# Altium schematic sheet FPGA power.SchDoc: FPGA power
size A4; Organization: Blinkinlabs, LLC; DocumentNumber: 11; SheetNumber: 12; SheetTotal: 14
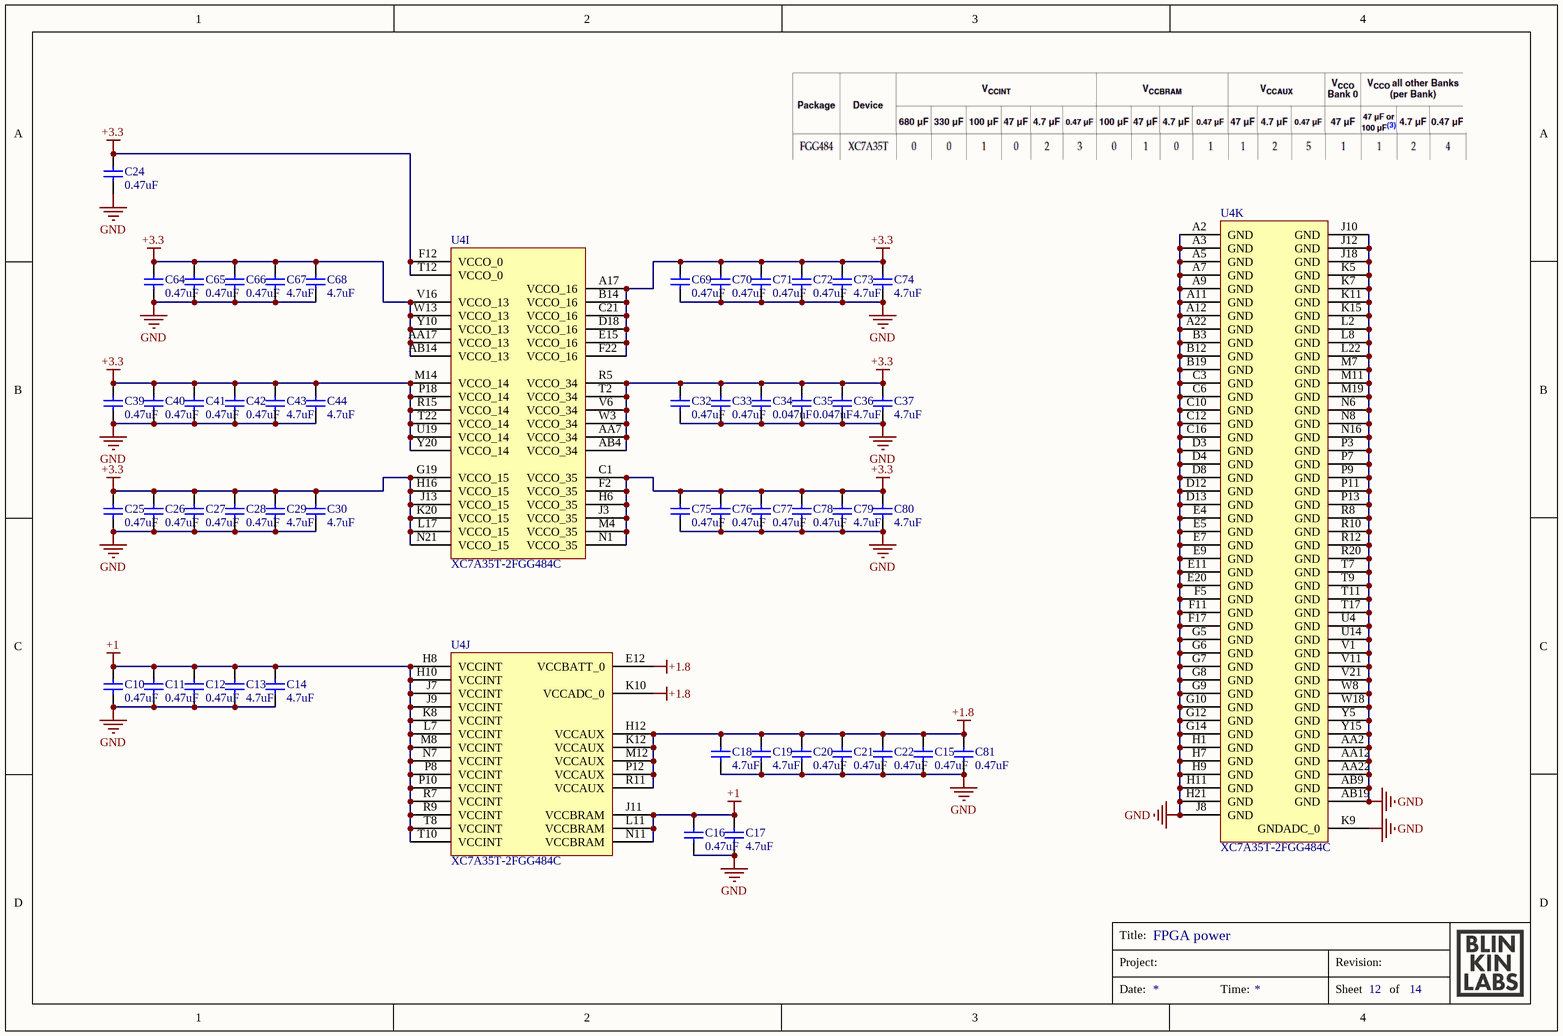
[diagram p0: FPGA power.SchDoc]

## Parts
C10  0.47uF  [CAPC1005X06L]
C11  0.47uF  [CAPC1005X06L]
C12  0.47uF  [CAPC1005X06L]
C13  4.7uF  [CAPC1005X06L]
C14  4.7uF  [CAPC1005X06L]
C15  0.47uF  [CAPC1005X06L]
C16  0.47uF  [CAPC1005X06L]
C17  4.7uF  [CAPC1005X06L]
C18  4.7uF  [CAPC1005X06L]
C19  4.7uF  [CAPC1005X06L]
C20  0.47uF  [CAPC1005X06L]
C21  0.47uF  [CAPC1005X06L]
C22  0.47uF  [CAPC1005X06L]
C24  0.47uF  [CAPC1005X06L]
C25  0.47uF  [CAPC1005X06L]
C26  0.47uF  [CAPC1005X06L]
C27  0.47uF  [CAPC1005X06L]
C28  0.47uF  [CAPC1005X06L]
C29  4.7uF  [CAPC1005X06L]
C30  4.7uF  [CAPC1005X06L]
C32  0.47uF  [CAPC1005X06L]
C33  0.47uF  [CAPC1005X06L]
C34  0.047uF  [CAPC1005X06L]
C35  0.047uF  [CAPC1005X06L]
C36  4.7uF  [CAPC1005X06L]
C37  4.7uF  [CAPC1005X06L]
C39  0.47uF  [CAPC1005X06L]
C40  0.47uF  [CAPC1005X06L]
C41  0.47uF  [CAPC1005X06L]
C42  0.47uF  [CAPC1005X06L]
C43  4.7uF  [CAPC1005X06L]
C44  4.7uF  [CAPC1005X06L]
C64  0.47uF  [CAPC1005X06L]
C65  0.47uF  [CAPC1005X06L]
C66  0.47uF  [CAPC1005X06L]
C67  4.7uF  [CAPC1005X06L]
C68  4.7uF  [CAPC1005X06L]
C69  0.47uF  [CAPC1005X06L]
C70  0.47uF  [CAPC1005X06L]
C71  0.47uF  [CAPC1005X06L]
C72  0.47uF  [CAPC1005X06L]
C73  4.7uF  [CAPC1005X06L]
C74  4.7uF  [CAPC1005X06L]
C75  0.47uF  [CAPC1005X06L]
C76  0.47uF  [CAPC1005X06L]
C77  0.47uF  [CAPC1005X06L]
C78  0.47uF  [CAPC1005X06L]
C79  4.7uF  [CAPC1005X06L]
C80  4.7uF  [CAPC1005X06L]
C81  0.47uF  [CAPC1005X06L]
U4  XC7A35T-2FGG484C  [FGG484]  (parts I,J,K of 12)

## Nets
+1: C10.1 C11.1 C12.1 C13.2 C14.2 C16.1 C17.2 U4.H8(VCCINT) U4.H10(VCCINT) U4.J7(VCCINT) U4.J9(VCCINT) U4.J11(VCCBRAM) U4.K8(VCCINT) U4.L7(VCCINT) U4.L11(VCCBRAM) U4.M8(VCCINT) U4.N7(VCCINT) U4.N11(VCCBRAM) U4.P8(VCCINT) U4.P10(VCCINT) U4.R7(VCCINT) U4.R9(VCCINT) U4.T8(VCCINT) U4.T10(VCCINT)
+1.8: C15.1 C18.2 C19.2 C20.1 C21.1 C22.1 C81.1 U4.E12(VCCBATT_0) U4.H12(VCCAUX) U4.K10(VCCADC_0) U4.K12(VCCAUX) U4.M12(VCCAUX) U4.P12(VCCAUX) U4.R11(VCCAUX)
+3.3: C24.1 C25.1 C26.1 C27.1 C28.1 C29.2 C30.2 C32.1 C33.1 C34.1 C35.1 C36.2 C37.2 C39.1 C40.1 C41.1 C42.1 C43.2 C44.2 C64.1 C65.1 C66.1 C67.2 C68.2 C69.1 C70.1 C71.1 C72.1 C73.2 C74.2 C75.1 C76.1 C77.1 C78.1 C79.2 C80.2 U4.A17(VCCO_16) U4.AA7(VCCO_34) U4.AA17(VCCO_13) U4.AB4(VCCO_34) U4.AB14(VCCO_13) U4.B14(VCCO_16) U4.C1(VCCO_35) U4.C21(VCCO_16) U4.D18(VCCO_16) U4.E15(VCCO_16) U4.F2(VCCO_35) U4.F12(VCCO_0) U4.F22(VCCO_16) U4.G19(VCCO_15) U4.H6(VCCO_35) U4.H16(VCCO_15) U4.J3(VCCO_35) U4.J13(VCCO_15) U4.K20(VCCO_15) U4.L17(VCCO_15) U4.M4(VCCO_35) U4.M14(VCCO_14) U4.N1(VCCO_35) U4.N21(VCCO_15) U4.P18(VCCO_14) U4.R5(VCCO_34) U4.R15(VCCO_14) U4.T2(VCCO_34) U4.T12(VCCO_0) U4.T22(VCCO_14) U4.U19(VCCO_14) U4.V6(VCCO_34) U4.V16(VCCO_13) U4.W3(VCCO_34) U4.W13(VCCO_13) U4.Y10(VCCO_13) U4.Y20(VCCO_14)
GND: C10.2 C11.2 C12.2 C13.1 C14.1 C15.2 C16.2 C17.1 C18.1 C19.1 C20.2 C21.2 C22.2 C24.2 C25.2 C26.2 C27.2 C28.2 C29.1 C30.1 C32.2 C33.2 C34.2 C35.2 C36.1 C37.1 C39.2 C40.2 C41.2 C42.2 C43.1 C44.1 C64.2 C65.2 C66.2 C67.1 C68.1 C69.2 C70.2 C71.2 C72.2 C73.1 C74.1 C75.2 C76.2 C77.2 C78.2 C79.1 C80.1 C81.2 U4.A2(GND) U4.A3(GND) U4.A5(GND) U4.A7(GND) U4.A9(GND) U4.A11(GND) U4.A12(GND) U4.A22(GND) U4.AA2(GND) U4.AA12(GND) U4.AA22(GND) U4.AB9(GND) U4.AB19(GND) U4.B3(GND) U4.B12(GND) U4.B19(GND) U4.C3(GND) U4.C6(GND) U4.C10(GND) U4.C12(GND) U4.C16(GND) U4.D3(GND) U4.D4(GND) U4.D8(GND) U4.D12(GND) U4.D13(GND) U4.E4(GND) U4.E5(GND) U4.E7(GND) U4.E9(GND) U4.E11(GND) U4.E20(GND) U4.F5(GND) U4.F11(GND) U4.F17(GND) U4.G5(GND) U4.G6(GND) U4.G7(GND) U4.G8(GND) U4.G9(GND) U4.G10(GND) U4.G12(GND) U4.G14(GND) U4.H1(GND) U4.H7(GND) U4.H9(GND) U4.H11(GND) U4.H21(GND) U4.J8(GND) U4.J10(GND) U4.J12(GND) U4.J18(GND) U4.K5(GND) U4.K7(GND) U4.K9(GNDADC_0) U4.K11(GND) U4.K15(GND) U4.L2(GND) U4.L8(GND) U4.L22(GND) U4.M7(GND) U4.M11(GND) U4.M19(GND) U4.N6(GND) U4.N8(GND) U4.N16(GND) U4.P3(GND) U4.P7(GND) U4.P9(GND) U4.P11(GND) U4.P13(GND) U4.R8(GND) U4.R10(GND) U4.R12(GND) U4.R20(GND) U4.T7(GND) U4.T9(GND) U4.T11(GND) U4.T17(GND) U4.U4(GND) U4.U14(GND) U4.V1(GND) U4.V11(GND) U4.V21(GND) U4.W8(GND) U4.W18(GND) U4.Y5(GND) U4.Y15(GND)

## Notes on the sheet
- Title:
- Project:
- Revision:
- Date:
- Time:
- Sheet
- of

## Library data of the parts
C10-C12 C15 C16 C20-C22 C24-C28 C32 C33 C39-C42 C64-C66 C69-C72 C75-C78 C81 = GRM155R60J474KE19D: CAP CER 0.47UF 6.3V X5R 0402; Manufacturer: Murata Electronics North America; Tolerance: ±10%; PartNumber: GRM155R60J474KE19D; Datasheets: http://www.murata.com/~/media/webrenewal/support/library/catalog/products/capacitor/mlcc/c02e.pdf; Image: //media.digikey.com/Renders/Murata%20Renders/ZRB-SERIES-0402.jpg; Digi-Key Part Number: 490-3266-1-ND; Packaging: Cut Tape (CT); Series: GRM; Value: 0.47uF; Voltage: 6.3V; Temperature Coefficient: X5R; Operating Temperature: -55°C ~ 85°C; Features: -; Applications: General Purpose; Package / Case: 0402 (1005 Metric); Case/Package: 0402
C13 C14 C17-C19 C29 C30 C36 C37 C43 C44 C67 C68 C73 C74 C79 C80 = GRM155R60G475ME47D: CAP CER 4.7UF 4V X5R 0402; Manufacturer: Murata Electronics North America; Tolerance: ±20%; PartNumber: GRM155R60G475ME47D; Datasheets: http://www.murata.com/~/media/webrenewal/support/library/catalog/products/capacitor/mlcc/c02e.pdf; Image: //media.digikey.com/Renders/Murata%20Renders/ZRB-SERIES-0402.jpg; Digi-Key Part Number: 490-11980-1-ND; Packaging: Cut Tape (CT); Series: GRM; Value: 4.7uF; Voltage: 4V; Temperature Coefficient: X5R; Operating Temperature: -55°C ~ 85°C; Features: -; Applications: General Purpose; Package / Case: 0402 (1005 Metric); Case/Package: 0402
C34 C35 = GRM155R60J473KA01D: CAP CER 0.047UF 6.3V X5R 0402; Manufacturer: Murata Electronics North America; Tolerance: ±10%; PartNumber: GRM155R60J473KA01D; Datasheets: http://www.murata.com/~/media/webrenewal/support/library/catalog/products/capacitor/mlcc/c02e.pdf; Image: //media.digikey.com/Renders/Murata%20Renders/ZRB-SERIES-0402.jpg; Digi-Key Part Number: 490-8250-1-ND; Packaging: Cut Tape (CT); Series: GRM; Value: 0.047uF; Voltage: 6.3V; Temperature Coefficient: X5R; Operating Temperature: -55°C ~ 85°C; Features: -; Applications: General Purpose; Package / Case: 0402 (1005 Metric); Case/Package: 0402
U4 = CMP-0383-00019-1: Artix-7 FPGA, 250 User I/Os, 4 GTP, 484-Ball BGA, Speed Grade 2, Commercial Grade, Pb-Free; Manufacturer: Xilinx; Total Block RAM: 1800 Kb; GTP: 4; Available User I/O: 250; Speed Grades: 2; Logic Cells: 33280; CMTs: 5; ComponentLink3URL: http://www.xilinx.com/support/documentation/user_guides/ug475_7Series_Pkg_Pinout.pdf; PackageVersion: Rev. 1.11; ComponentLink2Description: Datasheet; ComponentLink3Description: Pinout; PartNumber: XC7A35T-2FGG484C; DatasheetVersion: Rev. 1.15; Operating Temperature Range: Commercial; PackageDescription: 484-Ball Wire-Bond Fine-Pitch BGA, Body 23 x 23 mm, Pitch 1 mm; ComponentLink4Description: Package Specification; Maximum Distributed RAM: 400 Kb; Mounting Technology: Surface Mount; ComponentLink2URL: http://www.xilinx.com/support/documentation/data_sheets/ds180_7Series_Overview.pdf; ComponentLink1Description: Manufacturer URL; ComponentLink4URL: http://www.xilinx.com/support/documentation/user_guides/ug475_7Series_Pkg_Pinout.pdf; PackageReference: FGG484; ComponentLink1URL: http://www.xilinx.com/